# Altium schematic sheet IMU.SchDoc
size A
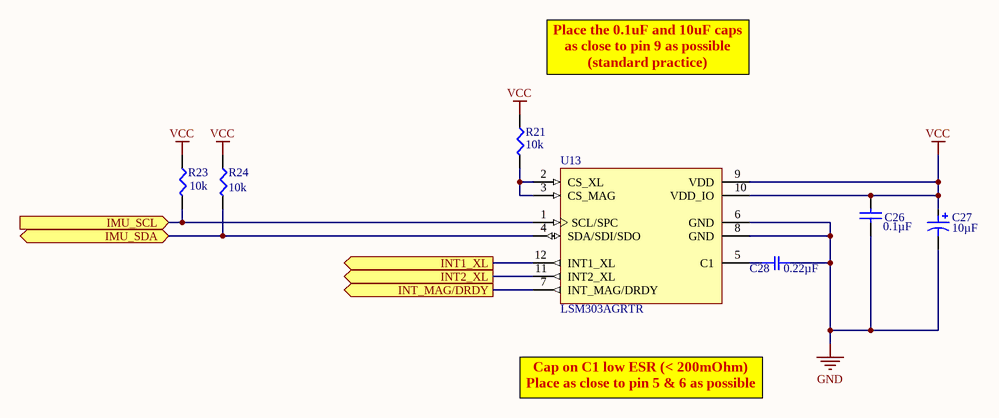
[diagram p0: IMU.SchDoc]

## Parts
C26  Capacitance: 0.1µF  [C0603N]  (hidden comment: CL10B104KO8NFNC)
C27  value 10µF  [2917]  (hidden comment: EEF-CD1B100R)
C28  value 0.22µF  [SMD-0603C]  (hidden comment: GCM188R71E224KA55J)
R21  value 10k  [SMD-0603-RES]  (hidden comment: ERJ-3EKF1002V)
R23  value 10k  [SMD-0603-RES]  (hidden comment: ERJ-3EKF1002V)
R24  value 10k  [SMD-0603-RES]  (hidden comment: ERJ-3EKF1002V)
U13  LSM303AGRTR  [LGA12R50P_200X200X100]

## Ports
IMU_SCL (in), IMU_SDA (bidir), INT1_XL (out), INT2_XL (out), INT_MAG/DRDY (out)

## Nets
GND: C26.1 C27.2 C28.2 U13.6(GND) U13.8(GND)
VCC: C26.2 C27.1 R21.1 R23.1 R24.1 U13.9(VDD) U13.10(VDD_IO)
IMU_SCL: R23.2 U13.1(SCL/SPC) ; port IMU_SCL
IMU_SDA: R24.2 U13.4(SDA/SDI/SDO) ; port IMU_SDA
INT1_XL: U13.12(INT1_XL) ; port INT1_XL
INT2_XL: U13.11(INT2_XL) ; port INT2_XL
INT_MAG/DRDY: U13.7(INT_MAG/DRDY) ; port INT_MAG/DRDY
NetC28_1: C28.1 U13.5(C1)
NetR21_2: R21.2 U13.2(CS_XL) U13.3(CS_MAG)

## Notes on the sheet
- Place the 0.1uF and 10uF caps as close to pin 9 as possible (standard practice)
- Cap on C1 low ESR (< 200mOhm)
  Place as close to pin 5 & 6 as possible

## Library data of the parts
C26 = CAPACITOR_NP: HOUSEPART: NO; POPULATE: 1; TOLERANCE: ±10%; VOLTAGE: 16V; Temperature Coefficient: X7R; DeviceName: CL10B104KO8NFNC; LibraryName: MF_Passives; DeviceSetName: CAPACITOR_NP; MPN: CL10B104KO8NFNC; URL: https://octopart.com/cl10b104ko8nfnc-samsung-19831587; MF_PARTNUM: CL10B104KO8NFNC
C27 = CAPACITOR_P: 10µF 12.5V Aluminum Polymer Capacitor 2917 (7343 Metric) 60 mOhm 1000 Hrs @ 105°C; HOUSEPART: NO; POPULATE: 1; TOLERANCE: 20%; DeviceSetName: CAPACITOR_P; MPN: EEF-CD1B100R; URL: https://www.digikey.com/product-detail/en/panasonic-electronic-components/EEF-CD1B100R/PCE3166CT-ND/256706; VOLTAGE: 12.5V
C28 = GCM188R71E224KA55J: CAP CER 0.22UF 25V X7R 0603; Manufacturer: Murata Electronics North America; Factory Stock: 0; Unit Price (USD): 0.1; Minimum Quantity: 1; Tolerance: ±10%; Datasheets: http://www.murata.com/~/media/webrenewal/support/library/catalog/products/capacitor/mlcc/c03e.ashx; Image: //media.digikey.com/Renders/Murata%20Renders/0603%28GCM188%29.jpg; Digi-Key Part Number: 490-8017-1-ND; Part Number: GCM188R71E224KA55J; Quantity Available: 10849; @ qty: 0; Packaging: Cut Tape (CT); Series: GCM; Part Status: Active; Voltage: 25V; Temperature Coefficient: X7R; Operating Temperature: -55°C ~ 125°C; Features: -; Ratings: AEC-Q200; Applications: Automotive; Mounting Type: Surface Mount, MLCC; Package / Case: 0603 (1608 Metric); Size / Dimension: 0.063" L x 0.031" W (1.60mm x 0.80mm); Height - Seated (Max): -; Thickness (Max): 0.035" (0.90mm); Lead Spacing: -; Lead Style: -
R21 R23 R24 = ERJ-3EKF1002V: RES SMD 10K OHM 1% 1/10W 0603; Manufacturer: Panasonic Electronic Components; Factory Stock: 0; Unit Price (USD): 0.00379; @ qty: 1500; Minimum Quantity: 1; Power (Watts): 0.1W, 1/10W; Temperature Coefficient: ±100ppm/°C; Part Number: ERJ-3EKF1002V; Datasheets: http://industrial.panasonic.com/www-cgi/jvcr13pz.cgi?E+PZ+3+AOA0002+ERJ3EKF1002V+7+WW; Image: //media.digikey.com/Photos/Panasonic%20Photos/MFG_ERJ-P6W%20Series.jpg; Digi-Key Part Number: P10.0KHCT-ND; Quantity Available: 6703141; Packaging: Cut Tape (CT); Series: ERJ; Part Status: Active; Tolerance: ±1%; Composition: Thick Film; Features: Automotive AEC-Q200; Operating Temperature: -55°C ~ 155°C; Package / Case: 0603 (1608 Metric); Supplier Device Package: 0603; Size / Dimension: 0.063" L x 0.031" W (1.60mm x 0.80mm); Height - Seated (Max): 0.022" (0.55mm); Number of Terminations: 2; Failure Rate: -
U13 = CMP-98f6527696964731-1: Ultra-compact high-performance eCompass module: ultra-low power 3D accelerometer and 3D magnetometer; Lifecycle Status: Active; Packaging: Cut Tape (CT); Octopart URL: http://octopart.com/lsm303agrtr-stmicroelectronics-59386630; Manufacturer Part Number: LSM303AGRTR; Case/Package: LGA-12